# EAGLE design blinkm_mk2m (EAGLE 6.6.0)
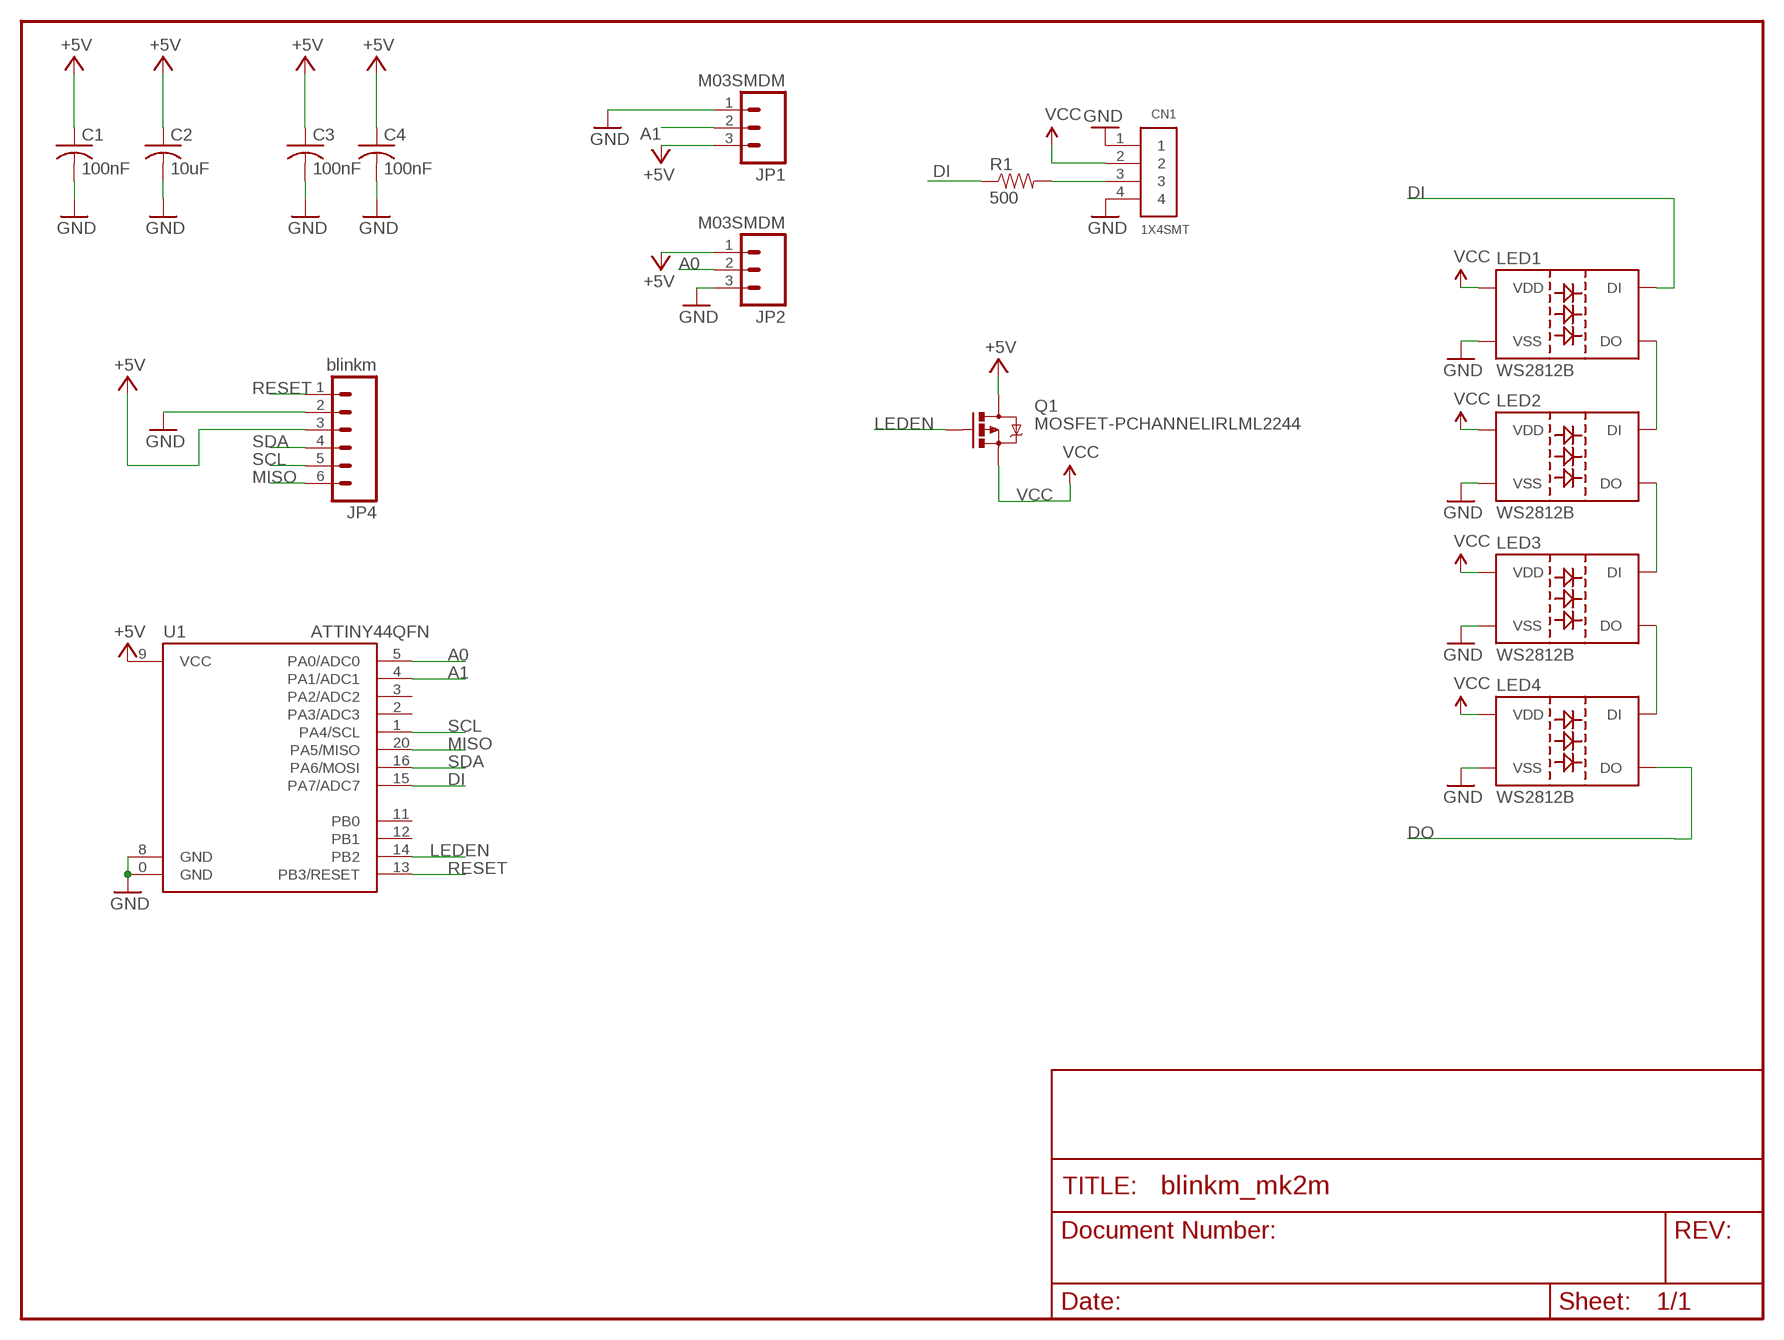
[diagram p0: schematic, sheet 1]

## Parts
C1  100nF  C-USC0603  [C0603]
C2  10uF  C-USC0603  [C0603]
C3  100nF  C-USC0603  [C0603]
C4  100nF  C-USC0603  [C0603]
CN1  1X4SMT  [1X4-SMT]
JP1  M03SMDM  [1X03-SMD-MINIMAL]
JP2  M03SMDM  [1X03-SMD-MINIMAL]
JP4  blinkm  M06LOCK  [1X06_LOCK]
LED1  WS2812B  [WS2812B]
LED2  WS2812B  [WS2812B]
LED3  WS2812B  [WS2812B]
LED4  WS2812B  [WS2812B]
Q1  MOSFET-PCHANNELIRLML2244  [SOT23-3]
R1  500  RESISTOR0603  [0603-RES]
U1  ATTINY44QFN  ATTINY24QFN  [QFN20]

## Nets
+5V: C1.1 C2.1 C3.1 C4.1 JP1.3 JP2.1 JP4.3 Q1.3(D) U1.9(VCC)
A0: JP2.2 U1.5(PA0/ADC0)
A1: JP1.2 U1.4(PA1/ADC1)
DI: LED1.4(DI) R1.1 U1.15(PA7/ADC7)
DO: LED4.2(DO)
DOI1: LED1.2(DO) LED2.4(DI)
DOI2: LED2.2(DO) LED3.4(DI)
GND: C1.2 C2.2 C3.2 C4.2 CN1.1 CN1.4 JP1.1 JP2.3 JP4.2 LED1.3(VSS) LED2.3(VSS) LED3.3(VSS) LED4.3(VSS) U1.0(GND) U1.8(GND)
LEDEN: Q1.1(G) U1.14(PB2)
MISO: JP4.6 U1.20(PA5/MISO)
N$1: CN1.3 R1.2
N$2: LED3.2(DO) LED4.4(DI)
RESET: JP4.1 U1.13(PB3/RESET)
SCL: JP4.5 U1.1(PA4/SCL)
SDA: JP4.4 U1.16(PA6/MOSI)
VCC: CN1.2 LED1.1(VDD) LED2.1(VDD) LED3.1(VDD) LED4.1(VDD) Q1.2(S)
Unconnected: U1.2(PA3/ADC3) U1.3(PA2/ADC2) U1.11(PB0) U1.12(PB1)

## Library data of the parts
C1-C4 = rcl:C-US: CAPACITOR, American symbol
CN1 = adafruit:1X4: 4-pin connector
JP1 JP2 = todstuff:M03
JP4 = SparkFun-Connectors:M06: Header 6 Standard 6-pin 0.1" header. Use with straight break away headers (SKU : PRT-00116), right angle break away headers (PRT-00553), swiss pins (PRT-00743), machine pins (PRT-00117), and female headers (PRT-00115). Molex polarized connector foot print use with SKU : PRT-08094 with associated crimp pins and housings. NOTES ON THE VARIANTS LOCK and LOCK_LONGPADS... This footprint was designed to help hold the alignment of a through-hole component (i.e. 6-pin header) while soldering it into place. You may notice that each hole has been shifted either up or down by 0.005 of an inch from it's more standard position (which is a perfectly straight line). This slight alteration caused the pins (the squares in the middle) to touch the edges of the holes. Because they are alternating, it causes a "brace" to hold the component in place. 0.005 has proven to be the perfect amount of "off-center" position when using our standard breakaway headers. Although looks a little odd when you look at the bare footprint, once you have a header in there, the alteration is very hard to notice. Also, if you push a header all the way into place, it is covered up entirely on the bottom side. This idea of altering the position of holes to aid alignment will be further integrated into the Sparkfun Library for other footprints. It can help hold any component with 3 or more connection pins.
LED1-LED4 = WS2812:WS2812B
Q1 = SparkFun-DiscreteSemi:MOSFET-PCHANNEL: Generic PMOSFET; PROD_ID: TRANS-11153
R1 = SparkFun-Resistors:RESISTOR: Resistor Basic schematic elements and footprints for 0603, 1206, and PTH resistors.
U1 = SparkFun-DigitalIC:ATTINY24: Atmel 20-pin 2kB flash uC

## Board
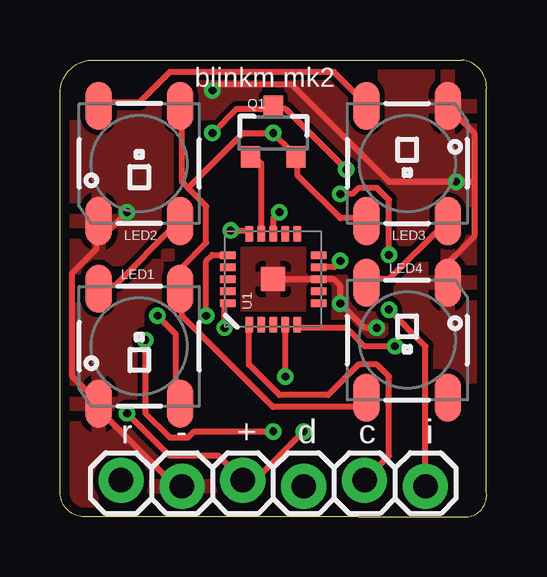
[diagram p1: board, top side]
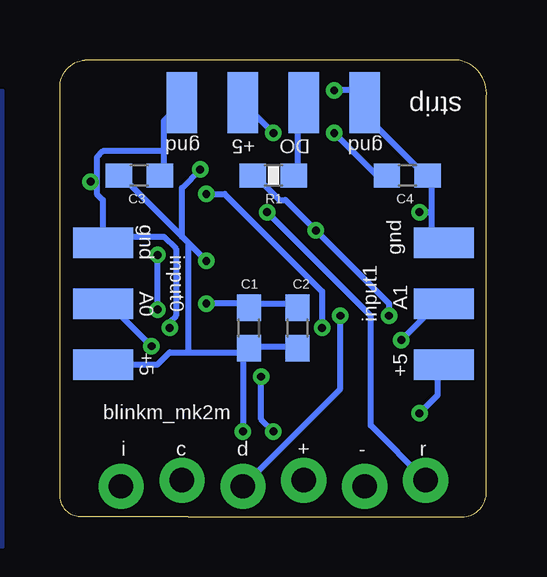
[diagram p2: board, bottom side, seen from below]

Size 17.79 x 19.05 mm. Coordinates in mm from the lower left corner, seen from the top.
Outline: 12.45,0 1.02,0 arc-90 0.01,1.02 0.01,17.53 arc-90 1.28,19.05 16.77,19.05 arc-90 17.79,17.78 17.79,1.02 arc-90 17.02,0 12.45,0
Copper layers (1*16): Top 0.0356mm / dielectric 1.5011mm / Bottom 0.0356mm
Design rules "LaenPCBOrder-tod *": minimum track width 10mil, minimum drill 13mil, track to track 8mil, track to pad 8mil, pad to pad 8mil, via to via 8mil, smd to smd 6mil, copper to edge 15mil, drill to drill 8mil, minimum pad ring 7mil, minimum via ring 7mil, stop-mask expansion 4mil, vias tented up to drill 25mil, thermal gap 10mil
vRestrict: area 7.9,9.1 to 9.9,11.2

### Footprints (pad centres in the part's own frame; a part is rotated, then mirrored left to right if it is on the bottom)
C0603 = smd 1.1 x 1: 1 -0.85,0; 2 0.85,0
1X4-SMT = smd 1.27 x 2.54: 1 -3.81,0; 2 -1.27,0; 3 1.27,0; 4 3.81,0
1X03-SMD-MINIMAL = smd 1.27 x 2.5: 1 -2.54,-0.01; 2 0,-0.01; 3 2.54,-0.01
1X06_LOCK = drill 1.016 pad 1.88: 1 0,0; 2 2.54,-0.254; 3 5.08,0; 4 7.62,-0.254; 5 10.16,0; 6 12.7,-0.254
WS2812B = smd 2 x 1.1: 1 2.4,-1.7; 2 2.4,1.7; 3 -2.4,1.7; 4 -2.4,-1.7
SOT23-3 = smd 0.8 x 0.9: 1 -0.95,-1; 2 0.95,-1; 3 0,1.1
0603-RES = smd 1.1 x 1: 1 -0.85,0; 2 0.85,0
QFN20 = smd 1 x 1: 0 0,0 | smd 0.65 x 0.3: 1 -1.9,1; 2 -1.9,0.5; 3 -1.9,0; 4 -1.9,-0.5; 5 -1.9,-1; 11 1.9,-1; 12 1.9,-0.5; 13 1.9,0; 14 1.9,0.5; 15 1.9,1 | smd 0.3 x 0.65: 6 -1,-1.9; 7 -0.5,-1.9; 8 0,-1.9; 9 0.5,-1.9; 10 1,-1.9; 16 1,1.9; 17 0.5,1.9; 18 0,1.9; 19 -0.5,1.9; 20 -1,1.9

### Placement (x,y rotation side)
C1  9.91,7.87 90 bottom
C2  7.88,7.87 90 bottom
C3  14.48,14.22 0 bottom
C4  3.31,14.22 0 bottom
CN1  8.9,17.27 0 bottom
JP1  1.78,8.89 270 bottom
JP2  16.01,8.89 90 bottom
JP4  2.55,1.52 0 top
LED1  3.31,7.11 90 top
LED2  3.31,14.73 90 top
LED3  14.48,14.73 270 top
LED4  14.48,7.37 270 top
Q1  8.9,16 0 top
R1  8.9,14.22 0 bottom
U1  8.9,9.91 90 top

### Tracks (layer width: path | path; a pad name or v marks a point on that pad's centre or on a via)
+5V  (via drill 0.33)
  Top 0.254: v2.8,4.32 4.58,2.54 6.61,2.54 JP4.3 8.13,1.52 v10.17,3.56 | 8.9,17.02 7.37,17.02 v6.36,16 | 8.9,17.02 Q1.3 8.9,17.02 | v11.69,10.67 11.44,10.41 10.93,10.41 U1.9 | 8.9,17.02 9.4,17.02 v11.94,14.48
  Bottom 0.254: v2.8,4.32 2.04,5.08 2.04,6.35 JP1.3 | C2.1 7.88,7.11 9.91,7.11 C1.1 | 12.45,6.86 13.21,6.86 13.72,6.35 15.75,6.35 JP2.1 | 12.45,6.86 10.17,6.86 | 10.17,6.86 9.91,6.86 C1.1 | v6.36,16 4.58,14.22 4.32,14.22 C4.1 | 12.71,11.68 15.25,14.22 C3.1 | 12.71,11.68 12.45,11.43 | 12.45,11.43 v11.69,10.67 | v11.94,14.48 12.71,13.72 12.71,11.68 | 12.45,11.43 12.45,6.86 | 10.17,6.86 v10.17,3.56 | 10.17,6.86 C1.1
A0  (via drill 0.33)
  Top 0.254: v13.98,7.11 12.71,7.11 11.94,7.87 9.91,7.87 U1.5
  Bottom 0.254: v13.98,7.11 15.75,8.89 JP2.2
A1  (via drill 0.33)
  Top 0.254: v9.4,5.84 9.4,7.87 U1.4 | v8.9,3.56 5.59,3.56 5.34,3.3 4.58,3.3 3.56,4.32 v3.56,7.37
  Bottom 0.254: v9.4,5.84 9.4,4.06 v8.9,3.56 | v3.56,7.37 2.04,8.89 JP1.2
DI  (via drill 0.33)
  Top 0.254: v7.12,11.94 7.88,11.94 U1.15 | v4.07,8.38 4.83,7.62 4.83,4.83 LED1.4
  Bottom 0.254: R1.1 9.66,14.22 8.64,13.21 8.39,13.21 v7.12,11.94 4.07,8.89 v4.07,8.38
DOI1
  Top 0.254: LED1.2 1.78,9.65 2.29,9.65 4.83,12.19 LED2.4
DOI2
  Top 0.254: LED2.2 1.78,17.27 3.31,17.27 4.58,18.54 11.44,18.54 12.71,17.27 LED3.4
GND  (via drill 0.33)
  Top 0.254: 17.28,13.97 17.28,16 16.26,17.02 LED3.3 | 17.28,13.97 17.28,11.68 16.26,10.67 16.26,9.91 LED4.3 | U1.0 10.67,9.91 U1.8 10.93,9.91 11.44,9.91 11.69,9.65 v11.69,8.89 12.71,7.87 v13.21,7.87 | 17.28,13.97 v16.52,13.97 13.72,13.97 9.66,18.03 6.61,18.03 v6.36,17.78 | JP4.2 4.83,1.27 1.78,4.32 1.78,4.57 LED1.3 1.53,4.83 0.51,5.84 0.51,10.16 1.53,11.18 1.53,11.43 | 1.53,11.43 1.53,12.19 LED2.3 1.53,11.43 | 1.53,11.43 v2.8,12.7
  Bottom 0.254: 9.91,8.89 7.88,8.89 C2.2 | 9.91,8.89 C1.2 9.91,8.89 | 9.91,8.89 v11.69,8.89 | 13.47,15.24 13.47,16.51 CN1.1 | 13.47,15.24 13.47,14.22 C3.2 | 16.01,11.68 16.01,13.21 16.26,13.46 16.26,13.97 | 16.01,11.68 JP2.3 16.01,11.68 | 16.26,13.97 16.26,14.99 16.01,15.24 13.47,15.24 | v13.21,7.87 13.21,8.13 12.96,8.38 12.96,11.18 13.47,11.68 16.01,11.68 | 16.26,13.97 v16.52,13.97 | 2.29,12.7 2.29,11.68 2.04,11.43 JP1.1 | 2.29,12.7 2.29,14.22 C4.2 2.55,14.22 5.09,16.76 CN1.4 5.59,17.78 v6.36,17.78 | v2.8,12.7 2.29,12.7
  pour Bottom: 22.36,17.78 22.36,-1.02 20.33,-1.27 20.33,17.78
  pour Top: 23.12,19.3 23.12,-2.29 -1.52,-1.27 -1.52,19.05
LEDEN
  Top 0.254: U1.14 8.39,11.94 8.39,14.73 8.13,14.99 Q1.1
MISO  (via drill 0.33)
  Top 0.254: v6.86,7.87 6.86,8.89 U1.20 | v11.69,13.46 12.2,13.46 12.45,13.72 13.21,13.72 13.72,13.21 v13.72,10.92 | v13.72,8.64 15.25,7.11 JP4.6
  Bottom 0.254: v6.86,7.87 6.86,9.4 10.93,13.46 v11.69,13.46 | v13.72,8.64 v13.72,10.92
N$1
  Bottom 0.254: CN1.3 7.88,17.02 7.88,14.22 R1.2
N$2
  Top 0.254: LED4.4 12.96,9.91 13.72,9.91 16.01,12.19 LED3.2
RESET  (via drill 0.33)
  Top 0.254: v9.15,12.7 8.9,12.45 8.9,11.94 U1.13
  Bottom 0.254: v9.15,12.7 4.83,8.38 4.83,3.81 JP4.1
SCL
  Top 0.254: JP4.5 13.72,2.54 13.72,5.84 13.21,6.35 12.45,6.35 11.18,5.08 9.15,5.08 7.88,6.35 7.88,7.87 U1.1
SDA  (via drill 0.33)
  Top 0.254: v6.1,8.38 6.1,10.67 6.36,10.92 6.86,10.92 U1.16
  Bottom 0.254: v6.1,8.38 6.1,5.33 JP4.4
VCC  (via drill 0.33)
  Top 0.254: LED3.1 12.71,12.45 11.69,12.45 9.91,14.22 9.91,14.99 Q1.2 9.66,15.24 v8.9,16 7.63,16 5.34,13.72 | LED4.1 12.71,4.83 12.45,4.57 8.9,4.57 5.09,8.38 5.09,9.4 LED1.1 5.09,9.65 5.09,10.41 6.1,11.43 6.1,12.95 5.34,13.72 | 5.34,13.72 5.09,13.97 5.09,17.02 LED2.1
  Bottom 0.254: v8.9,16 CN1.2

### Text on the board
tPlace: blinkm mk2 | r | - | + | d | c | i
bPlace: strip | gnd | DO | +5 | gnd | gnd | gnd | input0 | A1 | A0 | input1 | +5 | +5 | blinkm_mk2m | r | - | + | d | c | i